# EAGLE design userver_display (EAGLE 7.7.0)
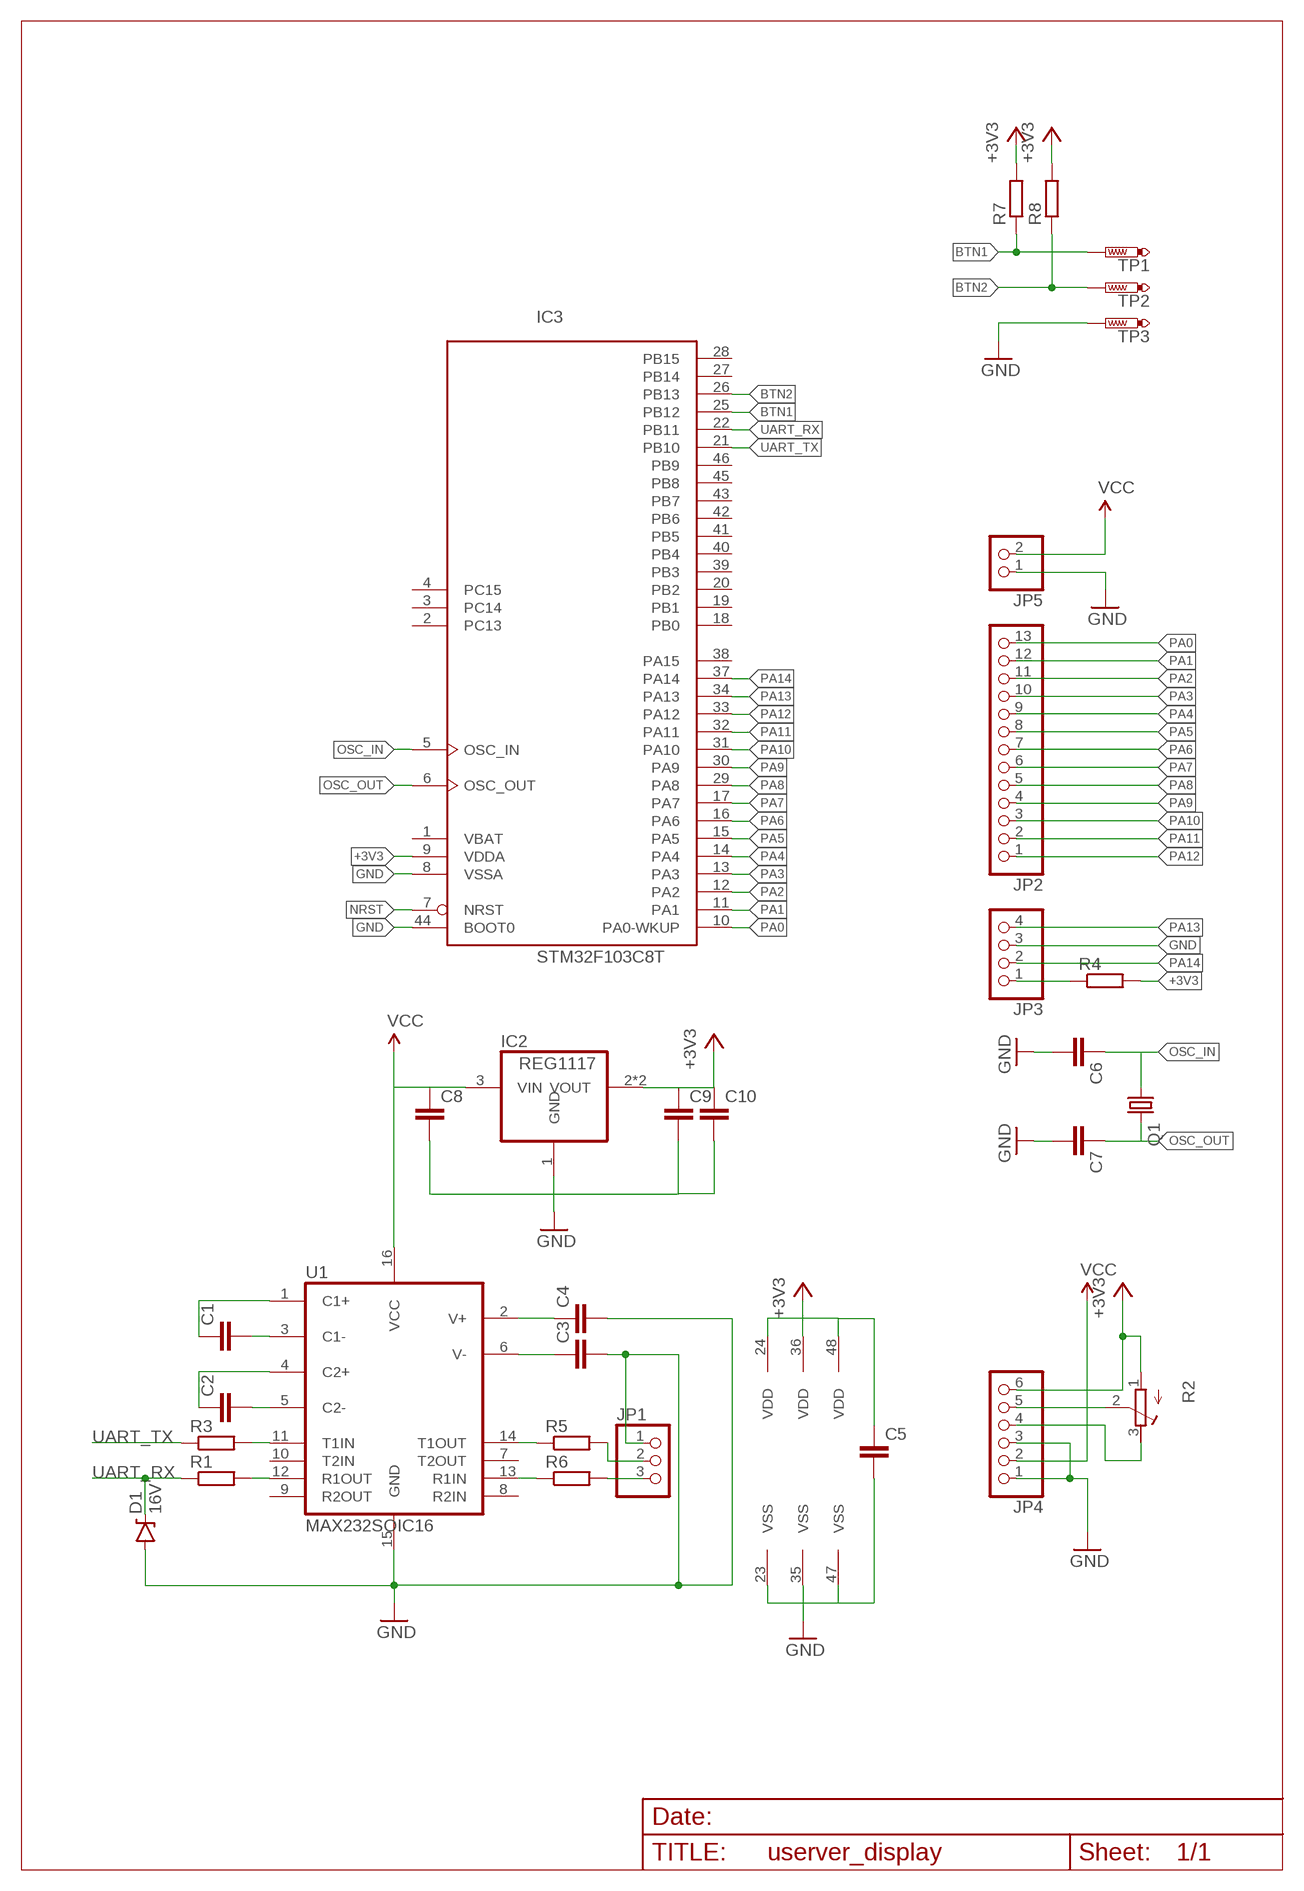
[diagram p0: schematic, sheet 1]

## Parts
C1  CC0805  [C0805]
C2  CC0805  [C0805]
C3  CC0805  [C0805]
C4  CC0805  [C0805]
C5  CC0805  [C0805]
C6  CC0603  [C0603]
C7  CC0603  [C0603]
C8  CC0805  [C0805]
C9  CC0805  [C0805]
C10  CC0805  [C0805]
D1  16V  DIODE-ZENER16V  [SOD-123]
IC2  REG1117  [SOT223]
IC3  STM32F103C8T  [LQFP48]
JP1  PINHD-1X3  [1X03]
JP2  PINHD-1X13  [1X13]
JP3  PINHD-1X4  [1X04]
JP4  PINHD-1X6  [1X06]
JP5  PINHD-1X2  [1X02]
Q1  CRYSTALHC49UP  [HC49UP]
R1  R0603  [0603]
R2  R-TRIMM64P  [RTRIM64P]
R3  R0603  [0603]
R4  R0603  [0603]
R5  R0603  [0603]
R6  R0603  [0603]
R7  R0603  [0603]
R8  R0603  [0603]
TP1  PTR1TP10SQ  [TP10SQ]
TP2  PTR1TP10SQ  [TP10SQ]
TP3  PTR1TP10SQ  [TP10SQ]
U1  MAX232SOIC16  [SO016]

## Nets
+3V3: C5.1 C9.1 C10.1 IC2.2(VOUT) IC2.4(VOUT) IC3.9(VDDA) IC3.24(VDD) IC3.36(VDD) IC3.48(VDD) JP4.6 R2.1(A) R4.2 R7.2 R8.2
BTN1: IC3.25(PB12) R7.1 TP1.TP
BTN2: IC3.26(PB13) R8.1 TP2.TP
GND: C3.2 C4.2 C5.2 C6.2 C7.2 C8.2 C9.2 C10.2 D1.A IC2.1(GND) IC3.8(VSSA) IC3.23(VSS) IC3.35(VSS) IC3.44(BOOT0) IC3.47(VSS) JP1.1 JP3.3 JP4.1 JP4.3 JP5.1 TP3.TP U1.15(GND)
N$1: JP1.2 R5.2
N$2: JP1.3 R6.2
N$3: C2.1 U1.4(C2+)
N$4: C2.2 U1.5(C2-)
N$5: C1.2 U1.3(C1-)
N$6: C1.1 U1.1(C1+)
N$7: C3.1 U1.6(V-)
N$8: R1.2 U1.12(R1OUT)
N$9: R3.2 U1.11(T1IN)
N$10: C4.1 U1.2(V+)
N$11: R6.1 U1.13(R1IN)
N$12: R5.1 U1.14(T1OUT)
N$31: JP4.4 R2.3(E)
N$32: JP4.5 R2.2(S)
NRST: IC3.7(NRST) JP3.1 R4.1
OSC_IN: C6.1 IC3.5(OSC_IN) Q1.1
OSC_OUT: C7.1 IC3.6(OSC_OUT) Q1.2
PA0: IC3.10(PA0-WKUP) JP2.13
PA1: IC3.11(PA1) JP2.12
PA2: IC3.12(PA2) JP2.11
PA3: IC3.13(PA3) JP2.10
PA4: IC3.14(PA4) JP2.9
PA5: IC3.15(PA5) JP2.8
PA6: IC3.16(PA6) JP2.7
PA7: IC3.17(PA7) JP2.6
PA8: IC3.29(PA8) JP2.5
PA9: IC3.30(PA9) JP2.4
PA10: IC3.31(PA10) JP2.3
PA11: IC3.32(PA11) JP2.2
PA12: IC3.33(PA12) JP2.1
PA13: IC3.34(PA13) JP3.4
PA14: IC3.37(PA14) JP3.2
UART_RX: D1.C IC3.22(PB11) R1.1
UART_TX: IC3.21(PB10) R3.1
VCC: C8.1 IC2.3(VIN) JP4.2 JP5.2 U1.16(VCC)
Unconnected: IC3.2(PC13) IC3.3(PC14) IC3.4(PC15) IC3.18(PB0) IC3.19(PB1) IC3.20(PB2) IC3.27(PB14) IC3.28(PB15) IC3.38(PA15) IC3.39(PB3) IC3.40(PB4) IC3.41(PB5) IC3.42(PB6) IC3.43(PB7) IC3.45(PB8) IC3.46(PB9) U1.7(T2OUT) U1.8(R2IN) U1.9(R2OUT) U1.10(T2IN)

## Power pins joined to a net without a drawn wire
VBAT: IC3.1(VBAT)

## Library data of the parts
C1-C10 = smalsmd:C: Capacitor
D1 = SparkFun-DiscreteSemi:DIODE-ZENER: Zener Diode Production Part - 8199 3.4V Zener Voltage; PROD_ID: DIO-12440
IC2 = burr-brown:REG1117: 800mA and 1A Low Dropout (LDO) Positive Regulator 1.8V, 2.5V, 2.85V, 3.3V, 5V, and Adj; MPN: REG1117; OC_FARNELL: 1097566; OC_NEWARK: 14P6981
IC3 = stm32:STM32F103C*T: ARM 32-bit Cortex™-M3 CPU 72 MHz maximum frequency 16 to 128 Kbytes of Flash memory 6 to 20 kbytes of SRAM 37 GPIOs 2.0 to 3.6 V application supply
JP1 = pinhead:PINHD-1X3: PIN HEADER
JP2 = pinhead:PINHD-1X13: PIN HEADER
JP3 = pinhead:PINHD-1X4: PIN HEADER
JP4 = pinhead:PINHD-1X6: PIN HEADER
JP5 = pinhead:PINHD-1X2: PIN HEADER
Q1 = crystal:CRYSTAL: CRYSTAL; OC_FARNELL: unknown; OC_NEWARK: unknown
R1 R3-R8 = smalsmd:R
R2 = rcl:R-TRIMM: Trimm resistor
TP1-TP3 = testpad:PTR1: TEST PIN
U1 = SparkFun-DigitalIC:MAX232: RS232 Transceiver Very common IC. This is generically called 'MAX232', but works with the 3V equivalent MAX3232 generic ICs. Field tested and mother approved. Spark Fun Electronics SKU : COM-00316 (DIP) and COM-00589 (SMD); PROD_ID: IC-08171

## Board
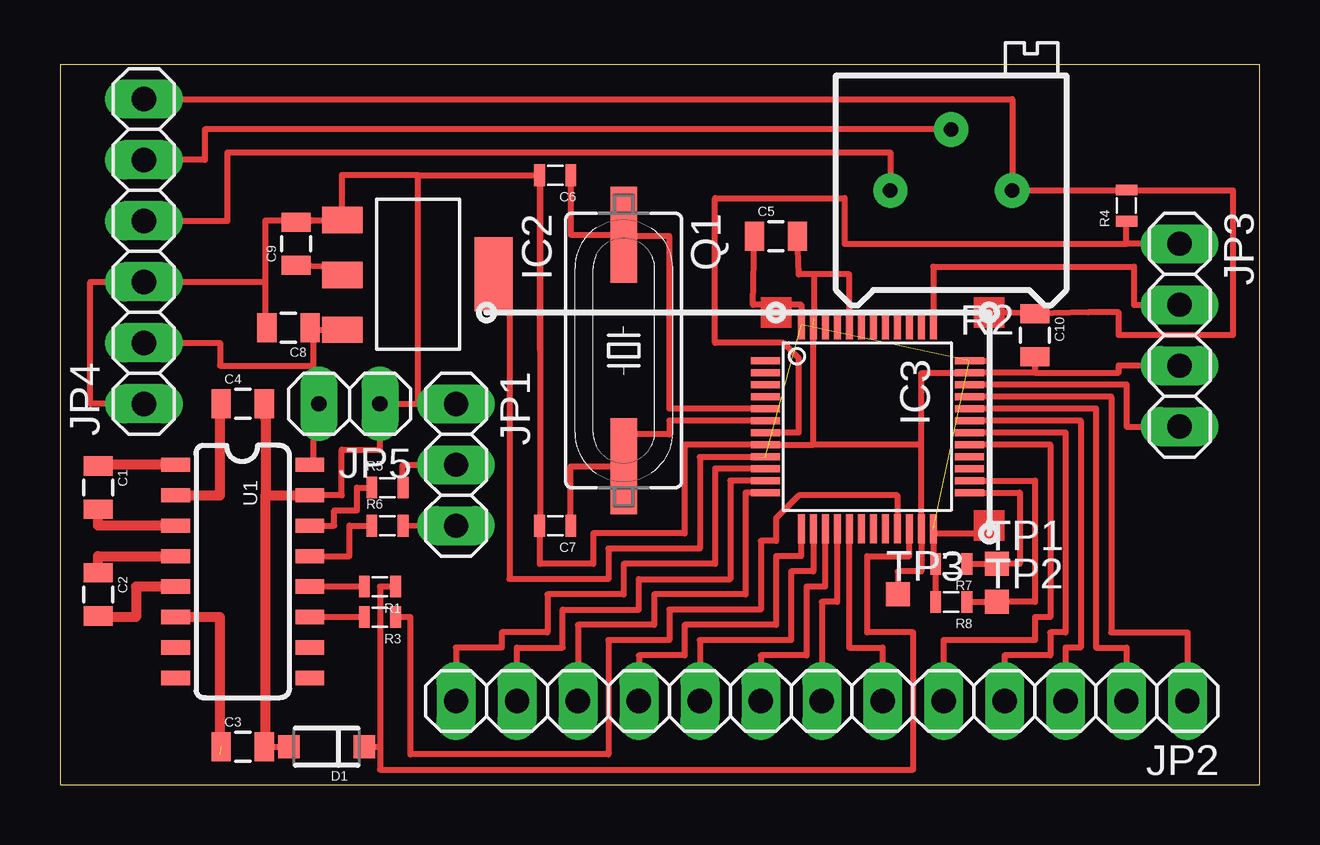
[diagram p1: board, top side]

Size 50 x 30 mm. Coordinates in mm from the lower left corner, seen from the top.
Outline: 0,0 50,0 50,30 0,30 0,0
Copper layers (1*16): Top 0.035mm / dielectric 1.5mm / Bottom 0.035mm
Design rules "SparkFun": minimum track width 8mil, minimum drill 20mil, track to track 8mil, track to pad 8mil, pad to pad 8mil, via to via 8mil, smd to smd 8mil, copper to edge 10mil, drill to drill 8mil, minimum pad ring 12mil, minimum via ring 10mil, stop-mask expansion 4mil, vias tented up to drill 25mil, thermal gap 10mil

### Footprints (pad centres in the part's own frame; a part is rotated, then mirrored left to right if it is on the bottom)
C0805 = smd 0.8 x 1.2: 1 -0.9,0; 2 0.9,0
C0603 = smd 0.45 x 0.9: 1 -0.65,0; 2 0.65,0
SOD-123 = smd 0.9 x 0.95: A 1.575,0; C -1.575,0
SOT223 = smd 1.1 x 1.7: 1 -2.261,-3.15; 2 0.025,-3.15; 3 2.311,-3.15 | smd 3.1 x 1.6: 4 0,3.15
LQFP48 = smd 0.3 x 1.2: 1 -2.75,-4.25; 2 -2.25,-4.25; 3 -1.75,-4.25; 4 -1.25,-4.25; 5 -0.75,-4.25; 6 -0.25,-4.25; 7 0.25,-4.25; 8 0.75,-4.25; 9 1.25,-4.25; 10 1.75,-4.25; 11 2.25,-4.25; 12 2.75,-4.25; 25 2.75,4.25; 26 2.25,4.25; 27 1.75,4.25; 28 1.25,4.25; 29 0.75,4.25; 30 0.25,4.25; 31 -0.25,4.25; 32 -0.75,4.25; 33 -1.25,4.25; 34 -1.75,4.25; 35 -2.25,4.25; 36 -2.75,4.25 | smd 1.2 x 0.3: 13 4.25,-2.75; 14 4.25,-2.25; 15 4.25,-1.75; 16 4.25,-1.25; 17 4.25,-0.75; 18 4.25,-0.25; 19 4.25,0.25; 20 4.25,0.75; 21 4.25,1.25; 22 4.25,1.75; 23 4.25,2.25; 24 4.25,2.75; 37 -4.25,2.75; 38 -4.25,2.25; 39 -4.25,1.75; 40 -4.25,1.25; 41 -4.25,0.75; 42 -4.25,0.25; 43 -4.25,-0.25; 44 -4.25,-0.75; 45 -4.25,-1.25; 46 -4.25,-1.75; 47 -4.25,-2.25; 48 -4.25,-2.75
1X03 = drill 1.016 long: 1 -2.54,0; 2 0,0; 3 2.54,0
1X13 = drill 1.016 long: 1 -15.24,0; 2 -12.7,0; 3 -10.16,0; 4 -7.62,0; 5 -5.08,0; 6 -2.54,0; 7 0,0; 8 2.54,0; 9 5.08,0; 10 7.62,0; 11 10.16,0; 12 12.7,0; 13 15.24,0
1X04 = drill 1.016 long: 1 -3.81,0; 2 -1.27,0; 3 1.27,0; 4 3.81,0
1X06 = drill 1.016 long: 1 -6.35,0; 2 -3.81,0; 3 -1.27,0; 4 1.27,0; 5 3.81,0; 6 6.35,0
1X02 = drill 0.635 pad 1.549 long: 1 -1.27,0; 2 1.27,0
HC49UP = smd 4 x 1.1: 1 -4.826,0; 2 4.826,0
0603 = smd 0.45 x 0.9: 1 -0.65,0; 2 0.65,0
RTRIM64P = drill 0.61 pad 1.422: 1 0,-2.54; 2 2.54,0; 3 0,2.54
TP10SQ = smd 1 x 1: TP 0,0
SO016 = smd 0.6 x 1.2: 1 -4.445,-2.8; 2 -3.175,-2.8; 3 -1.905,-2.8; 4 -0.635,-2.8; 5 0.635,-2.8; 6 1.905,-2.8; 7 3.175,-2.8; 8 4.445,-2.8; 9 4.445,2.8; 10 3.175,2.8; 11 1.905,2.8; 12 0.635,2.8; 13 -0.635,2.8; 14 -1.905,2.8; 15 -3.175,2.8; 16 -4.445,2.8

### Placement (x,y rotation side)
C1  1.59,12.38 270 top
C2  1.59,7.94 270 top
C3  7.62,1.59 0 top
C4  7.62,15.88 0 top
C5  29.84,22.86 0 top
C6  20.64,25.4 180 top
C7  20.64,10.79 180 top
C8  9.53,19.05 180 top
C9  9.84,22.54 90 top
C10  40.64,18.73 270 top
D1  11.11,1.59 180 top
IC2  14.92,21.27 270 top
IC3  33.66,14.92 270 top
JP1  16.51,13.34 270 top
JP2  31.75,3.49 180 top
JP3  46.67,18.73 270 top
JP4  3.49,22.23 90 top
JP5  12.06,15.88 180 top
Q1  23.5,18.1 270 top
R1  13.34,8.26 180 top
R2  37.15,24.77 90 top
R3  13.34,6.99 180 top
R4  44.45,24.13 90 top
R5  13.65,12.38 0 top
R6  13.65,10.79 0 top
R7  37.15,9.21 180 top
R8  37.15,7.62 180 top
TP1  39.05,9.21 0 top
TP2  39.05,7.62 0 top
TP3  34.92,7.94 0 top
U1  7.62,8.89 270 top

### Tracks (layer width: path | path; a pad name or v marks a point on that pad's centre or on a via)
+3V3  (4 unrouted)
  Top 0.254: 29.16,13.65 26.67,13.65 26.67,9.84 22.86,9.84 22.86,8.57 18.73,8.57 18.73,21.27 IC2.4 | C9.1 11.77,21.59 IC2.2 | JP4.6 39.69,28.57 R2.1 44.77,24.77 | 44.77,24.77 48.9,24.77 48.9,18.73 44.13,18.73 44.13,19.68 42.86,19.68 C10.1 38.73,19.68 | 38.73,19.68 38.73,17.67 IC3.36 | C5.1 28.89,20 30.91,20 IC3.48 | 38.73,19.68 39.69,19.68 | IC3.24 36.41,10.48 | 36.41,10.48 38.73,10.48 | R4.2 44.77,24.77 | R8.2 R7.2 36.41,9.3 36.41,10.48
BTN1
  Top 0.254: R7.1 TP1.TP 40.01,9.21 40.01,12.17 IC3.25
BTN2
  Top 0.254: R8.1 TP2.TP 40.64,7.62 40.64,12.67 IC3.26
GND  (1 unrouted)
  Top 0.254: C4.2 8.57,15.24 | 8.57,20.95 8.57,18.73 C8.2 | 8.57,20.95 8.57,23.52 10.48,23.53 | 10.48,23.53 IC2.1 11.75,23.52 11.75,25.4 14.92,25.4 | 40.64,17.17 44.13,17.17 44.13,17.46 JP3.3 | JP1.1 14.92,15.88 | U1.15 11.75,12.06 11.75,13.97 13.34,13.97 JP5.1 14.92,15.88 | C9.2 10.48,23.49 10.48,23.53 | 8.57,20.95 JP4.3 1.27,20.95 1.27,15.88 JP4.1 | 14.92,15.88 14.92,25.4 | 14.92,25.4 20,25.4 20,10.79 | 31.43,21.27 32.91,21.27 IC3.44 | 31.43,21.27 31.43,19.42 | C6.2 20,10.79 | C7.2 20,10.79 | 20,10.79 20,9.21 22.23,9.21 22.23,10.48 26.04,10.48 26.04,14.17 IC3.8 31.41,14.17 | 31.43,21.27 30.8,21.27 C5.2 | C10.2 40.64,17.17 | 40.64,17.17 IC3.35 37.91,17.14 35.91,17.14 35.91,14.17 | 31.41,14.17 IC3.47 | 35.91,14.17 IC3.23 35.91,8.89 34.92,8.89 TP3.TP | 35.91,14.17 31.41,14.17 | C3.2 D1.A
  Top 0.406: C3.2 8.57,1.27 8.57,12.06 | 8.57,12.06 U1.15 | C4.2 8.57,15.88 8.57,15.24 8.57,12.06
N$1
  Top 0.254: 16.19,13.35 JP1.2 14.29,13.34 14.29,12.38 R5.2
N$2
  Top 0.254: R6.2 16.19,10.81 JP1.3
N$3
  Top 0.406: C2.1 1.59,9.53 U1.4
N$4
  Top 0.406: U1.5 3.17,8.26 3.17,6.99 1.59,6.99 C2.2
N$5
  Top 0.406: U1.3 1.59,10.79 C1.2
N$6
  Top 0.406: U1.1 1.59,13.34 C1.1
N$7  (1 unrouted)
  Top 0.406: 6.67,1.27 6.67,6.99 U1.6
N$8
  Top 0.254: R1.2 U1.12
N$9
  Top 0.254: R3.2 U1.11
N$10
  Top 0.406: U1.2 6.67,12.06 6.67,15.88 C4.1
N$11
  Top 0.254: U1.13 12.06,9.53 12.06,10.79 R6.1
N$12
  Top 0.254: U1.14 11.43,10.79 11.43,11.43 12.38,11.43 12.38,12.38 R5.1
N$31
  Top 0.254: JP4.4 6.99,23.5 6.99,26.35 34.61,26.35 R2.3
N$32
  Top 0.254: R2.2 6.03,27.3 6.03,26.04 JP4.5
NRST
  Top 0.254: 44.45,22.54 R4.1 | JP3.1 44.45,22.54 | 44.45,22.54 32.7,22.54 32.7,24.45 27.3,24.45 27.3,18.41 30.16,18.41 30.8,17.78 30.8,14.67 IC3.7
OSC_IN
  Top 0.254: C6.1 21.29,22.92 Q1.1 23.5,22.86 25.4,22.86 25.4,15.67 IC3.5
OSC_OUT
  Top 0.254: C7.1 21.29,13.27 Q1.2 23.5,14.61 25.4,14.61 25.4,15.17 IC3.6
PA0
  Top 0.254: JP2.13 16.51,5.71 18.41,5.71 18.41,6.35 20.32,6.35 20.32,7.94 23.5,7.94 23.5,9.21 27.3,9.21 27.3,13.02 27.3,13.17 IC3.10
PA1
  Top 0.254: JP2.12 19.05,5.71 20.95,5.71 20.95,7.3 24.13,7.3 24.13,8.57 27.94,8.57 27.94,12.67 IC3.11
PA2
  Top 0.254: JP2.11 21.59,6.67 24.77,6.67 24.77,7.94 28.57,7.94 28.57,12.06 28.57,12.17 IC3.12
PA3
  Top 0.254: JP2.10 24.13,5.4 26.04,5.4 26.04,6.67 29.84,6.67 29.84,9.53 30.91,9.53 IC3.13
PA4
  Top 0.254: JP2.9 26.67,6.03 30.48,6.03 30.48,8.89 31.41,8.89 IC3.14
PA5
  Top 0.254: JP2.8 29.21,5.4 31.11,5.4 31.11,8.26 31.91,8.26 IC3.15
PA6
  Top 0.254: JP2.7 31.75,7.62 32.41,7.62 IC3.16
PA7
  Top 0.254: JP2.6 34.29,5.71 32.91,5.71 IC3.17
PA8
  Top 0.254: JP2.5 36.83,6.03 40.64,6.03 40.64,6.99 41.27,6.99 41.27,14.17 IC3.29
PA9
  Top 0.254: JP2.4 39.37,5.4 41.27,5.4 41.27,6.35 41.91,6.35 41.91,14.67 IC3.30
PA10
  Top 0.254: JP2.3 41.91,5.71 42.55,5.71 42.55,15.17 IC3.31
PA11
  Top 0.254: JP2.2 44.45,5.71 43.18,5.71 43.18,15.67 IC3.32
PA12
  Top 0.254: JP2.1 46.99,6.35 43.81,6.35 43.81,16.17 IC3.33
PA13
  Top 0.254: JP3.4 44.45,14.92 44.45,16.67 IC3.34
PA14
  Top 0.254: JP3.2 44.77,20 44.77,21.59 36.41,21.59 IC3.37
UART_RX
  Top 0.254: R1.1 13.34,8.26 13.34,1.59 | 13.34,1.59 13.34,0.64 35.56,0.64 35.56,6.35 33.66,6.35 33.66,9.53 35.41,9.53 IC3.22 | D1.C 13.34,1.59
UART_TX
  Top 0.254: R3.1 14.61,6.99 14.61,1.27 22.86,1.27 22.86,6.03 25.4,6.03 25.4,7.3 29.21,7.3 29.21,10.16 29.84,10.16 29.84,11.11 30.8,12.06 34.91,12.06 IC3.21
VCC
  Top 0.254: U1.16 10.57,13.34 10.57,15.88 | 10.57,15.88 10.57,17.46 | 10.57,17.46 10.57,18.73 | 10.57,18.73 10.57,18.96 IC2.3 | C8.1 10.57,18.73 | JP4.2 6.67,18.41 6.67,17.46 10.57,17.46 | JP5.2 10.57,15.88
(copper drawn outside any net)
  shapes: Top area x3